# EAGLE design teensy_featherwing_pcb (EAGLE 9.6.2)
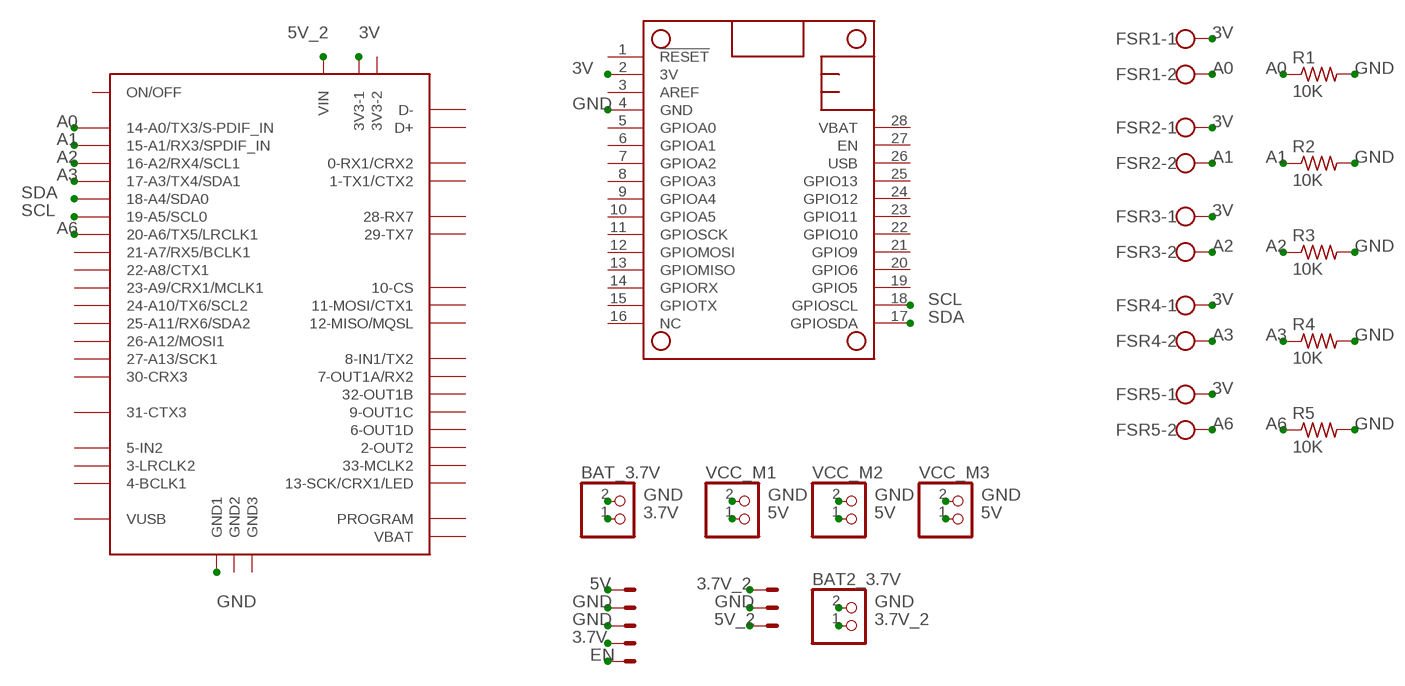
[diagram p0: schematic, sheet 1]

## Parts
5V_1A  22-23-2031  [22-23-2031]
5V_3A  22-23-2051  [22-23-2051]
BAT2_3.7V  JST_2PIN-THM  [JST-PH-2-THM]
BAT_3.7V  JST_2PIN-THM  [JST-PH-2-THM]
DC_MOTOR_DRIVER  FEATHERWING_NODIM  [FEATHERWING_DIM]
FSR1  W237-102  [W237-102]
FSR2  W237-102  [W237-102]
FSR3  W237-102  [W237-102]
FSR4  W237-102  [W237-102]
FSR5  W237-102  [W237-102]
R1  10K  R-US_0207/10  [0207/10]
R2  10K  R-US_0207/10  [0207/10]
R3  10K  R-US_0207/10  [0207/10]
R4  10K  R-US_0207/10  [0207/10]
R5  10K  R-US_0207/10  [0207/10]
U$1  TEENSY40  [TEENSY40]
VCC_M1  JST_2PIN-THM  [JST-PH-2-THM]
VCC_M2  JST_2PIN-THM  [JST-PH-2-THM]
VCC_M3  JST_2PIN-THM  [JST-PH-2-THM]

## Nets
3.7V: 5V_3A.4 BAT_3.7V.1
3.7V_2: 5V_1A.1 BAT2_3.7V.1
3V: DC_MOTOR_DRIVER.2(3V) FSR1.1 FSR2.1 FSR3.1 FSR4.1 FSR5.1 U$1.3V3-1
5V: 5V_3A.1 VCC_M1.1 VCC_M2.1 VCC_M3.1
5V_2: 5V_1A.3 U$1.VIN
A0: FSR1.2 R1.1 U$1.14-A0/TX3/S-PFI_OUT(14-A0/TX3/S-PDIF_IN)
A1: FSR2.2 R2.1 U$1.15-A1/RX3/S-PDIF_IN(15-A1/RX3/SPDIF_IN)
A2: FSR3.2 R3.1 U$1.16-A2/RX4/SCL1
A3: FSR4.2 R4.1 U$1.17-A3/TX4/SDA1
A6: FSR5.2 R5.1 U$1.20-A6/TX5/LRCLK1
EN: 5V_3A.5
GND: 5V_1A.2 5V_3A.2 5V_3A.3 BAT2_3.7V.2 BAT_3.7V.2 DC_MOTOR_DRIVER.4(GND) R1.2 R2.2 R3.2 R4.2 R5.2 U$1.GND1 VCC_M1.2 VCC_M2.2 VCC_M3.2
SCL: DC_MOTOR_DRIVER.18(GPIOSCL) U$1.19-A5/SCL0
SDA: DC_MOTOR_DRIVER.17(GPIOSDA) U$1.18-A4/SDA0
Unconnected: DC_MOTOR_DRIVER.1(!RESET) DC_MOTOR_DRIVER.3(AREF) DC_MOTOR_DRIVER.5(GPIOA0) DC_MOTOR_DRIVER.6(GPIOA1) DC_MOTOR_DRIVER.7(GPIOA2) DC_MOTOR_DRIVER.8(GPIOA3) DC_MOTOR_DRIVER.9(GPIOA4) DC_MOTOR_DRIVER.10(GPIOA5) DC_MOTOR_DRIVER.11(GPIOSCK) DC_MOTOR_DRIVER.12(GPIOMOSI) DC_MOTOR_DRIVER.13(GPIOMISO) DC_MOTOR_DRIVER.14(GPIORX) DC_MOTOR_DRIVER.15(GPIOTX) DC_MOTOR_DRIVER.16(NC) DC_MOTOR_DRIVER.19(GPIO5) DC_MOTOR_DRIVER.20(GPIO6) DC_MOTOR_DRIVER.21(GPIO9) DC_MOTOR_DRIVER.22(GPIO10) DC_MOTOR_DRIVER.23(GPIO11) DC_MOTOR_DRIVER.24(GPIO12) DC_MOTOR_DRIVER.25(GPIO13) DC_MOTOR_DRIVER.26(USB) DC_MOTOR_DRIVER.27(EN) DC_MOTOR_DRIVER.28(VBAT) U$1.0-RX1(0-RX1/CRX2) U$1.1-TX1(1-TX1/CTX2) U$1.2-OUT2 U$1.3-LRCLK2 U$1.3V3-2 U$1.4-BCLK2(4-BCLK1) U$1.5-IN2 U$1.6-OUT1D U$1.7-RX2/OUT1A(7-OUT1A/RX2) U$1.8-TX2/IN1(8-IN1/TX2) U$1.9-OUT1C U$1.10-CS/MQSR(10-CS) U$1.11-MOSI/CTX1 U$1.12-MIO/MQSL(12-MISO/MQSL) U$1.13-SCK/CRX1/LED U$1.21-A7/RX5/BCLK1 U$1.22-A8/CTX1 U$1.23-A9/CRX1/CCLK1(23-A9/CRX1/MCLK1) U$1.24-A10/TX6/SCL2 U$1.25-A11/SDA2(25-A11/RX6/SDA2) U$1.26-A12/MOSI1 U$1.27-A13/SCK1 U$1.28-RX7 U$1.29-TX7 U$1.30-CRX3 U$1.31-CTX3 U$1.32-OUTB1(32-OUT1B) U$1.33-MCLK2 U$1.D+ U$1.D- U$1.GND2 U$1.GND3 U$1.ON/OFF U$1.PROGRAM U$1.VBAT U$1.VUSB

## Library data of the parts
5V_1A = con-molex:22-23-2031: .100" (2.54mm) Center Header - 3 Pin; MF: MOLEX; MPN: 22-23-2031; OC_FARNELL: 1462950; OC_NEWARK: 30C0862
5V_3A = con-molex:22-23-2051: .100" (2.54mm) Center Header - 5 Pin; MF: MOLEX; MPN: 22-23-2051; OC_FARNELL: 1462952; OC_NEWARK: 38C9178
BAT2_3.7V BAT_3.7V VCC_M1-VCC_M3 = adafruit:JST_2PIN: JST 2-Pin Connectors of various flavors SMT-RA (S2B-PH-SM4) 4UConnector #17311 SMT (B2B-PH-SM4) THM-RA (S2B-PH) THM (B2B-PH)
DC_MOTOR_DRIVER = adafruit:FEATHERWING
FSR1-FSR5 = con-wago-500:W237-102: WAGO SCREW CLAMP; MPN: 237-102; OC_FARNELL: unknown; OC_NEWARK: 70K9898
R1-R5 = adafruit:R-US_: RESISTOR, American symbol
U$1 = teensy:TEENSY40: Teensy 4.0 device including POGO pins for pins 24 - 33, but not yet pins for D+ and D-. Symbol layout is what works for me and may not suite everyone... that can be added or additional symbols can be created to be used in a modilied davie name.

## Board
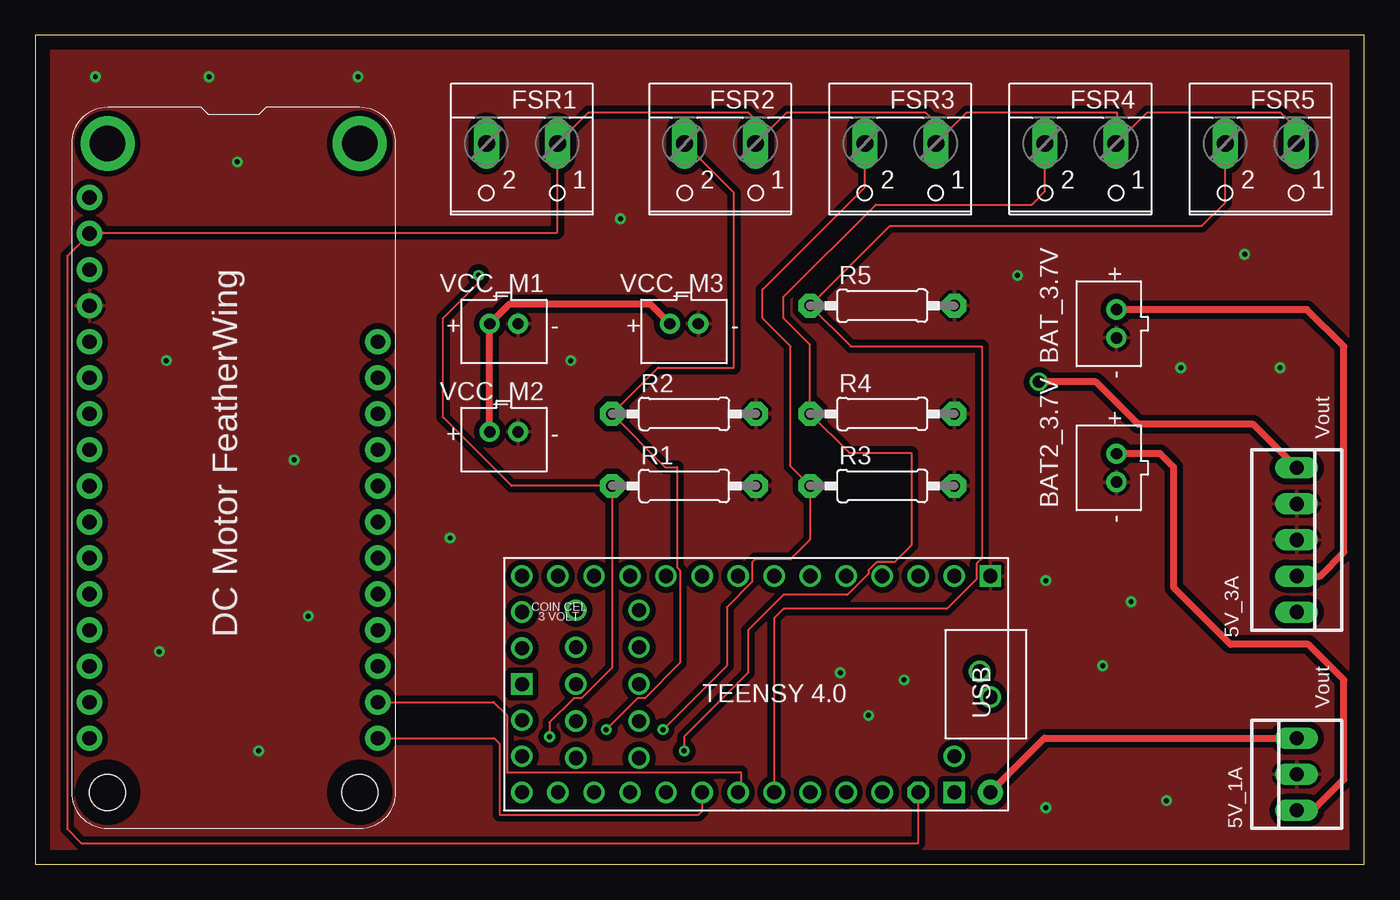
[diagram p1: board, top side]
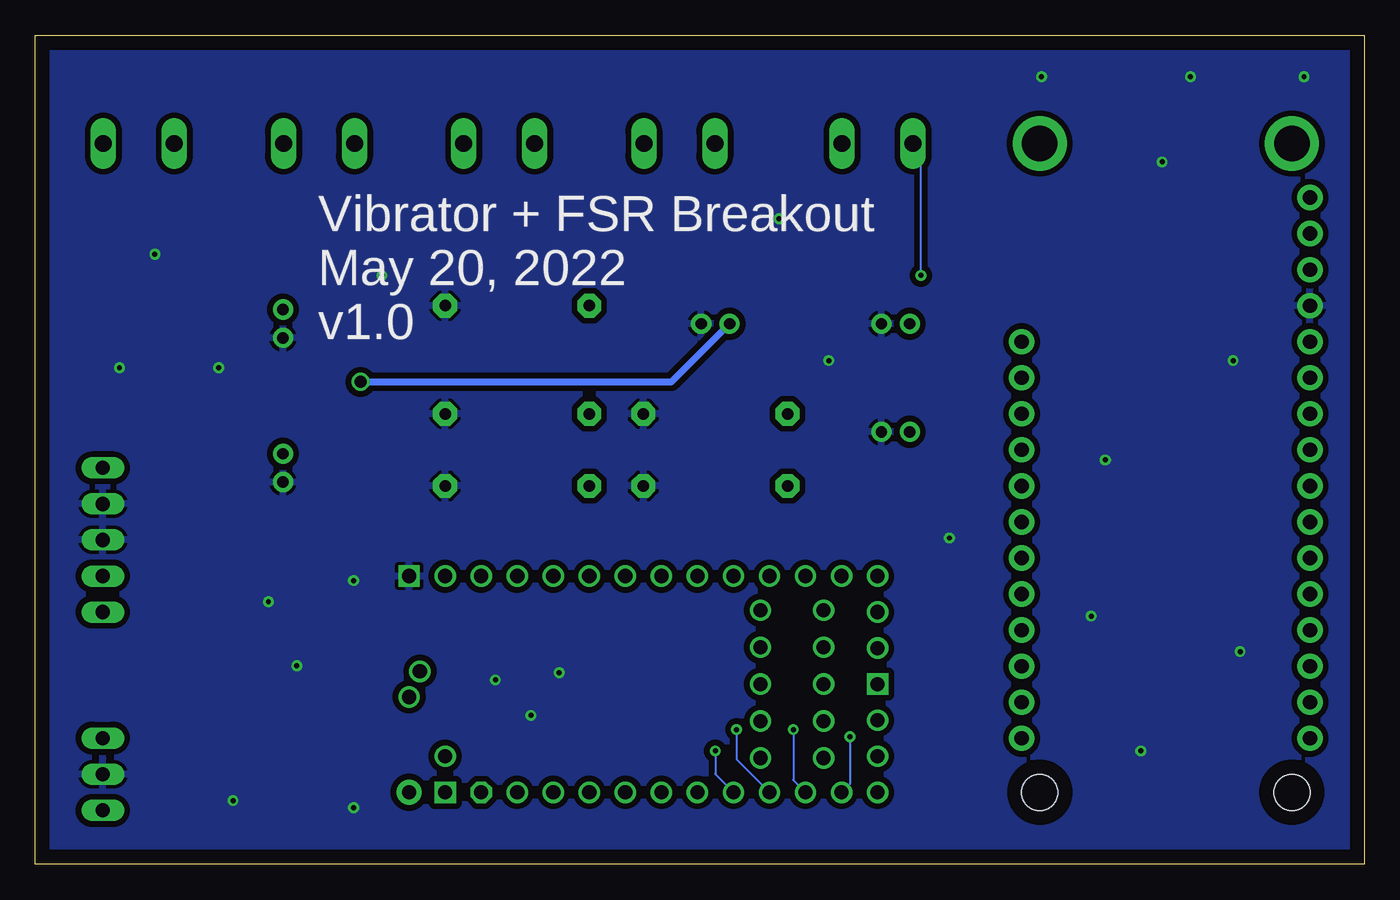
[diagram p2: board, bottom side, seen from below]

Size 93.65 x 58.41 mm. Coordinates in mm from the lower left corner, seen from the top.
Outline: 0,0 93.65,0 93.65,58.41 0,58.41 0,0
Copper layers (1*16): Top 0.035mm / dielectric 1.5mm / Bottom 0.035mm
Design rules "default": minimum track width 6mil, minimum drill 0.35mm, track to track 6mil, track to pad 6mil, pad to pad 6mil, via to via 6mil, smd to smd 6mil, copper to edge 40mil, drill to drill 6mil, minimum pad ring 10mil, minimum via ring 8mil, stop-mask expansion 4mil, vias tented up to drill 0mil, thermal gap 10mil

### Footprints (pad centres in the part's own frame; a part is rotated, then mirrored left to right if it is on the bottom)
22-23-2031 = drill 1 long: 1 -2.54,0; 2 0,0; 3 2.54,0
22-23-2051 = drill 1 long: 1 -5.08,0; 2 -2.54,0; 3 0,0; 4 2.54,0; 5 5.08,0
JST-PH-2-THM = drill 0.8 pad 1.422: 1 1,0; 2 -1,0
FEATHERWING_DIM = drill 1 pad 1.778: 1 6.35,1.27; 2 8.89,1.27; 3 11.43,1.27; 4 13.97,1.27; 5 16.51,1.27; 6 19.05,1.27; 7 21.59,1.27; 8 24.13,1.27; 9 26.67,1.27; 10 29.21,1.27; 11 31.75,1.27; 12 34.29,1.27; 13 36.83,1.27; 14 39.37,1.27; 15 41.91,1.27; 16 44.45,1.27; 17 44.45,21.59; 18 41.91,21.59; 19 39.37,21.59; 20 36.83,21.59; 21 34.29,21.59; 22 31.75,21.59; 23 29.21,21.59; 24 26.67,21.59; 25 24.13,21.59; 26 21.59,21.59; 27 19.05,21.59; 28 16.51,21.59 | drill 2.5 pad 3.81: P$1 2.54,20.32; P$2 2.54,2.54 | hole 2.54: 48.26,20.32; 48.26,2.54
W237-102 = drill 1.194 long: 1 -2.5,-1.27; 2 2.5,-1.27
0207/10 = drill 0.813 pad 1.676 octagon: 1 -5.08,0; 2 5.08,0
TEENSY40 = drill 1: 0-RX1 -13.97,-7.62; 1-TX1 -11.43,-7.62; 2-OUT2 -8.89,-7.62; 3-LRCLK2 -6.35,-7.62; 3V3-2 16.51,-2.54; 4-BCLK2 -3.81,-7.62; 5-IN2 -1.27,-7.62; 6-OUT1D 1.27,-7.62; 7-RX2/OUT1A 3.81,-7.62; 8-TX2/IN1 6.35,-7.62; 9-OUT1C 8.89,-7.62; 10-CS/MQSR 11.43,-7.62; 11-MOSI/CTX1 13.97,-7.62; 12-MIO/MQSL 16.51,-7.62; 13-SCK/CRX1/LED 16.51,7.62; 14-A0/TX3/S-PFI_OUT 13.97,7.62; 15-A1/RX3/S-PDIF_IN 11.43,7.62; 16-A2/RX4/SCL1 8.89,7.62; 17-A3/TX4/SDA1 6.35,7.62; 18-A4/SDA0 3.81,7.62; 19-A5/SCL0 1.27,7.62; 20-A6/TX5/LRCLK1 -1.27,7.62; 21-A7/RX5/BCLK1 -3.81,7.62; 22-A8/CTX1 -6.35,7.62; 23-A9/CRX1/CCLK1 -8.89,7.62; 24-A10/TX6/SCL2 12.7,5.207; 25-A11/SDA2 8.255,5.207; 26-A12/MOSI1 12.7,2.603; 27-A13/SCK1 8.255,2.603; 28-RX7 12.7,0; 29-TX7 8.255,0; 30-CRX3 12.7,-2.603; 31-CTX3 8.255,-2.603; 32-OUTB1 12.7,-5.207; 33-MCLK2 8.255,-5.207; D+ -15.75,-0.9; D- -16.51,0.9; ON/OFF 16.51,5.08; PROGRAM 16.51,2.54; VBAT 16.51,-5.08; VUSB -13.97,5.08 | drill 1 octagon: 3V3-1 -11.43,7.62 | drill 1 square: GND1 -16.51,-7.62; GND2 16.51,0; GND3 -13.97,7.62 | drill 1 pad 1.778: VIN -16.51,7.62

### Placement (x,y rotation side)
5V_1A  88.9,6.35 90 top
5V_3A  88.9,22.86 270 top
BAT2_3.7V  76.2,27.94 90 top
BAT_3.7V  76.2,38.1 90 top
DC_MOTOR_DRIVER  2.54,53.34 270 top
FSR1  34.29,49.53 180 top
FSR2  48.26,49.53 180 top
FSR3  60.96,49.53 180 top
FSR4  73.66,49.53 180 top
FSR5  86.36,49.53 180 top
R1  45.72,26.67 0 top
R2  45.72,31.75 0 top
R3  59.69,26.67 0 top
R4  59.69,31.75 0 top
R5  59.69,39.37 0 top
U$1  50.8,12.7 180 top
VCC_M1  33.02,38.1 180 top
VCC_M2  33.02,30.48 180 top
VCC_M3  45.72,38.1 180 top

### Tracks (layer width: path | path; a pad name or v marks a point on that pad's centre or on a via)
3.7V
  Top 0.508: 5V_3A.4 90.55,20.32 92.23,22 92.23,36.5 89.63,39.1 BAT_3.7V.1
3.7V_2
  Top 0.508: 5V_1A.1 90.04,3.81 92.23,6 92.23,13 89.73,15.5 84.23,15.5 80.23,19.5 80.23,28 79.29,28.94 BAT2_3.7V.1
3V
  Top 0.152: U$1.3V3-1 62.23,1.5 3.23,1.5 2.23,2.5 2.23,42.87 DC_MOTOR_DRIVER.2 3.86,44.5 36.73,44.5 36.79,44.56 FSR1.1 38.99,53 50.23,53 50.76,52.47 FSR2.1 52.96,53 62.73,53 63.46,52.27 FSR3.1 65.66,53 76.23,53 76.23,50.87 FSR4.1 78.36,53 87.73,53 88.86,51.87 FSR5.1
5V  (via drill 0.85)
  Top 0.508: 5V_3A.1 85.84,31 77.73,31 74.73,34 v70.73,34 | VCC_M2.1 VCC_M1.1 33.42,39.5 43.32,39.5 VCC_M3.1
  Bottom 0.508: v70.73,34 48.82,34 VCC_M3.1
5V_2
  Top 0.508: U$1.VIN 71.12,8.89 5V_1A.3
A0  (via drill 0.35)
  Top 0.152: v31.23,41.5 31.23,41 28.73,38.5 28.73,31.5 33.56,26.67 R1.1 40.64,13.85 38.51,11.72 37.95,11.72 36.23,10 v36.23,9
  Bottom 0.152: v31.23,41.5 31.23,50.24 FSR1.2 | v36.23,9 36.23,5.68 U$1.14-A0/TX3/S-PFI_OUT
A1  (via drill 0.35)
  Top 0.152: FSR2.2 49.23,47.33 49.23,35 43.89,35 R2.1 44.39,28 45.23,28 45.23,20.93 45.43,20.73 45.43,14.2 42.95,11.72 42.45,11.72 v40.23,9.5
  Bottom 0.152: v40.23,9.5 40.23,5.94 U$1.15-A1/RX3/S-PDIF_IN
A2  (via drill 0.35)
  Top 0.152: FSR3.2 58.46,47.73 51.23,40.5 51.23,38.5 53.23,36.5 53.23,28.05 R3.1 54.61,22.88 53.23,21.5 50.73,21.5 50.51,21.28 50.51,19.91 48.73,18.13 48.73,14 v44.23,9.5
  Bottom 0.152: v44.23,9.5 44.23,7.4 U$1.16-A2/RX4/SCL1
A3  (via drill 0.35)
  Top 0.152: FSR4.2 71.16,47.43 70.23,46.5 59.23,46.5 52.73,40 52.73,38.5 54.61,36.62 R4.1 57.36,29 61.73,29 61.73,22.5 60.53,21.3 59.28,21.3 58.71,20.73 58.71,20.49 57.22,19 52.73,19 50.23,16.5 50.23,13.5 45.73,9 v45.73,8
  Bottom 0.152: v45.73,8 45.73,6.36 U$1.17-A3/TX4/SDA1
A6
  Top 0.152: FSR5.2 83.86,46.63 82.23,45 60.24,45 R5.1 57.48,36.5 66.73,36.5 66.73,21.57 66.33,21.17 66.33,20.1 64.23,18 52.73,18 52.07,17.34 U$1.20-A6/TX5/LRCLK1
GND  (via drill 0.35)
  other vias: 4.23,55.5 12.23,55.5 22.73,55.5 14.23,49.5 9.23,35.5 8.73,15 18.23,28.5 19.23,17.5 15.73,8 29.23,23 41.23,45.5 37.73,35.5 69.23,41.5 85.23,43 80.73,35 87.73,35 71.23,20 77.23,18.5 75.23,14 71.23,4 79.73,4.5 56.73,13.5 61.23,13 58.73,10.5
  pour Bottom (isolate 0.406): 0.23,58.5 93.73,58.5 93.73,0 0.23,0
  pour Top (isolate 0.406): 0.23,58.5 93.73,58.5 93.73,0 0.23,0
SCL
  Top 0.152: DC_MOTOR_DRIVER.18 32.3,11.43 33.23,10.5 33.23,6.5 49.73,6.5 49.73,5.28 U$1.19-A5/SCL0
SDA
  Top 0.152: U$1.18-A4/SDA0 46.99,3.76 46.73,3.5 32.73,3.5 32.73,8.5 32.34,8.89 DC_MOTOR_DRIVER.17

### Text on the board
tPlace: Vout | DC Motor FeatherWing | Vout
bPlace: Vibrator + FSR Breakout / May 20, 2022 / v1.0